# EAGLE design plug_in_A (EAGLE 9.5.2)
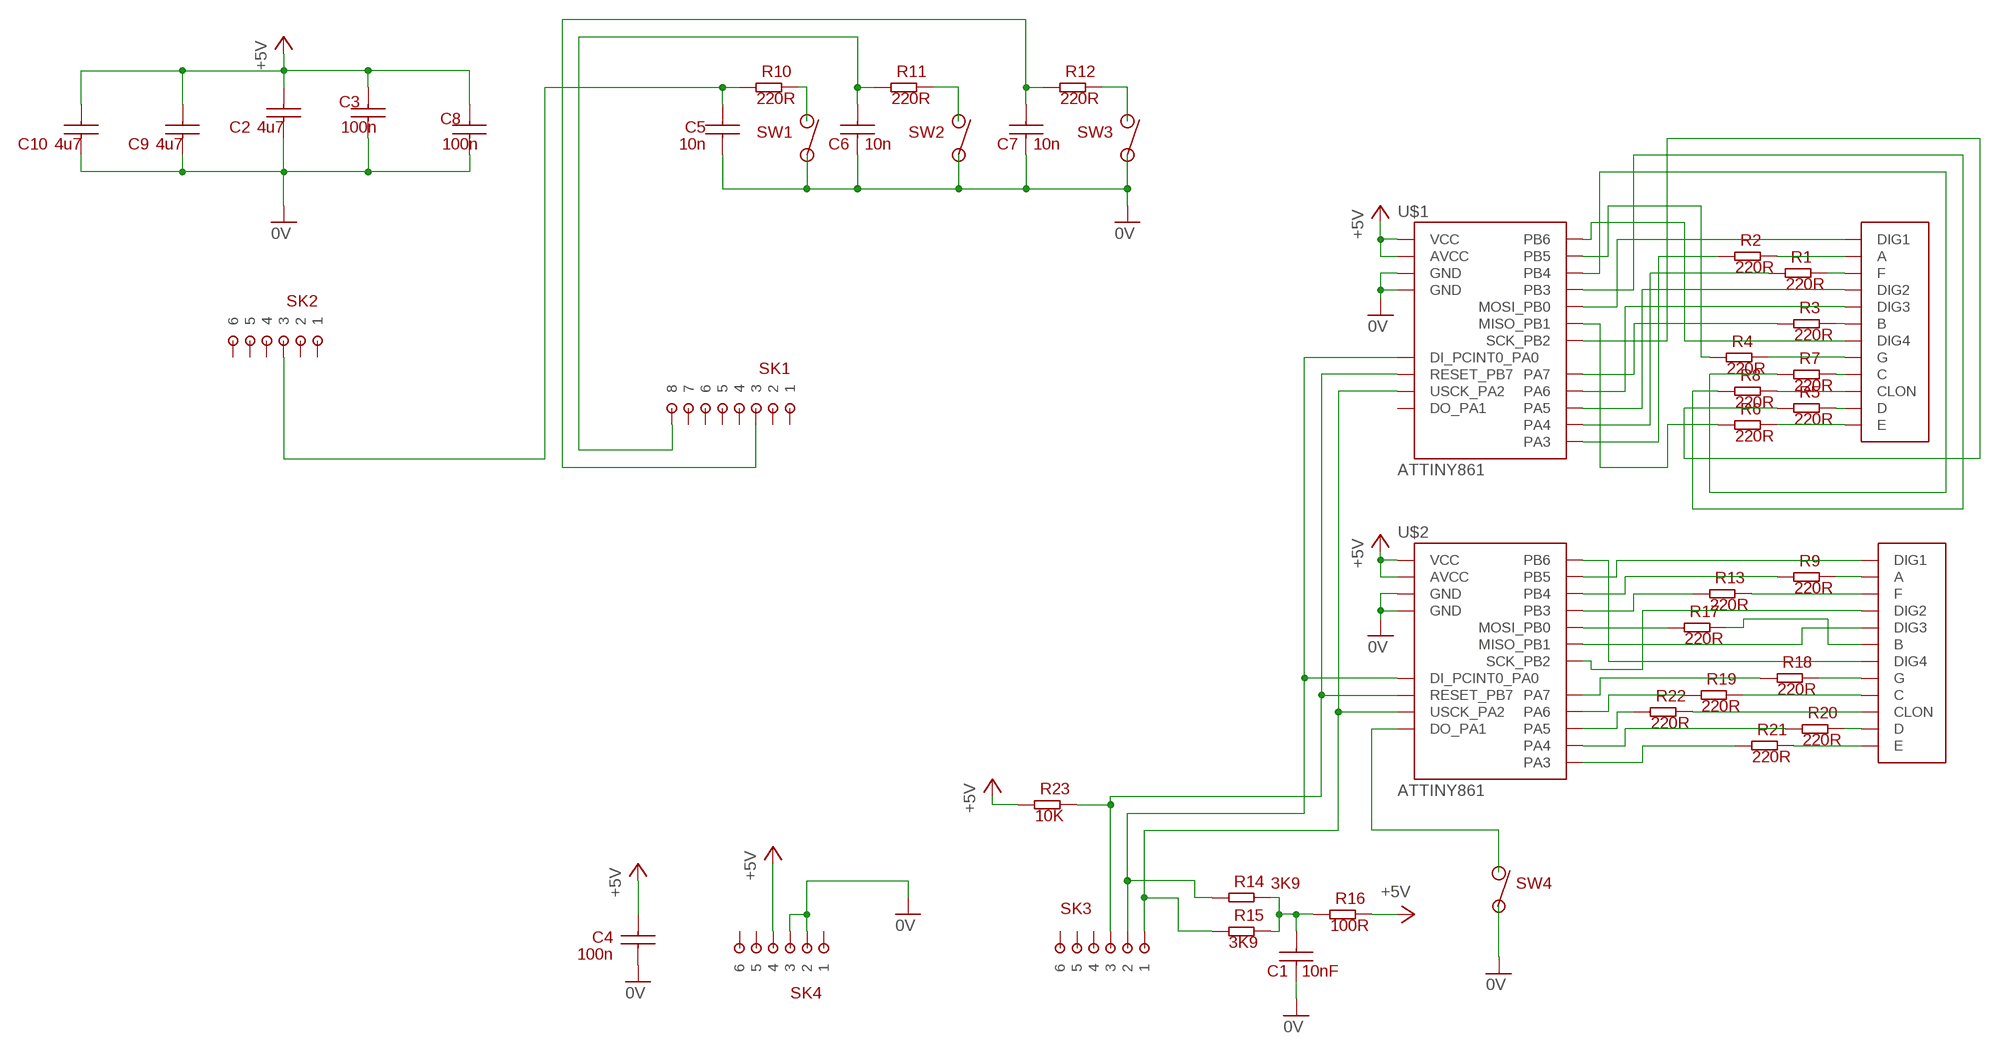
[diagram p0: schematic, sheet 1]

## Parts
C1  10nF  CAPACITOR  [1206]
C2  4u7  CAPACITOR  [1206]
C3  100n  CAPACITOR  [1206]
C4  100n  CAPACITOR  [1206]
C5  10n  CAPACITOR  [1206]
C6  10n  CAPACITOR  [1206]
C7  10n  CAPACITOR  [1206]
C8  100n  CAPACITOR  [1206]
C9  4u7  CAPACITOR  [1206]
C10  4u7  CAPACITOR  [1206]
R1  220R  RESISTOR  [1206]
R2  220R  RESISTOR  [1206]
R3  220R  RESISTOR  [1206]
R4  220R  RESISTOR  [1206]
R5  220R  RESISTOR  [1206]
R6  220R  RESISTOR  [1206]
R7  220R  RESISTOR  [1206]
R8  220R  RESISTOR  [1206]
R9  220R  RESISTOR  [1206]
R10  220R  RESISTOR  [1206]
R11  220R  RESISTOR  [1206]
R12  220R  RESISTOR  [1206]
R13  220R  RESISTOR  [1206]
R14  3K9  RESISTOR  [1206]
R15  3K9  RESISTOR  [1206]
R16  100R  RESISTOR  [1206]
R17  220R  RESISTOR  [1206]
R18  220R  RESISTOR  [1206]
R19  220R  RESISTOR  [1206]
R20  220R  RESISTOR  [1206]
R21  220R  RESISTOR  [1206]
R22  220R  RESISTOR  [1206]
R23  10K  RESISTOR  [1206]
SK1  8_WAY_HEADER  [8_WAY_HEADER]
SK2  6_WAY_HEADER  [6_WAY_HEADER]
SK3  6_WAY_HEADER  [6_WAY_HEADER]
SK4  6_WAY_HEADER  [6_WAY_HEADER]
SW1  BP_TH_NO  [PB_NO_TH]
SW2  BP_TH_NO  [PB_NO_TH]
SW3  BP_TH_NO  [PB_NO_TH]
SW4  PUSH_BUTTON_NO_SM  [PUSH_BUTTON_NO_SM]
U$1  ATTINY861  [DIL20]
U$2  ATTINY861  [DIL20]
U$3  DISPLAY  [DISPLAY]
U$4  DISPLAY  [DISPLAY]

## Nets
0V: C1.P$1 C2.P$1 C3.P$1 C4.P$1 C5.P$1 C6.P$1 C7.P$1 C8.P$1 C9.P$1 C10.P$1 SK4.P$2 SK4.P$3 SW1.P$2 SW2.P$2 SW3.P$2 SW4.P$2 U$1.6(GND) U$1.16(GND) U$2.6(GND) U$2.16(GND)
+5V: C2.P$2 C3.P$2 C4.P$2 C8.P$2 C9.P$2 C10.P$2 R16.P$2 R23.P$1 SK4.P$4 U$1.5(VCC) U$1.15(AVCC) U$2.5(VCC) U$2.15(AVCC)
N$1: SW4.P$1 U$2.19(DO_PA1)
N$2: U$1.1(MOSI_PB0) U$3.P$12(DIG1)
N$3: U$1.12(PA6) U$3.P$8(DIG3)
N$4: U$1.13(PA5) U$3.P$9(DIG2)
N$5: R2.P$1 U$1.17(PA3)
N$6: R23.P$2 SK3.P$3 U$1.10(RESET_PB7) U$2.10(RESET_PB7)
N$7: R20.P$1 U$2.14(PA4)
N$8: R6.P$1 U$1.2(MISO_PB1)
N$9: U$1.9(PB6) U$3.P$6(DIG4)
N$10: R14.P$1 SK3.P$2 U$1.20(DI_PCINT0_PA0) U$2.20(DI_PCINT0_PA0)
N$11: R15.P$1 SK3.P$1 U$1.18(USCK_PA2) U$2.18(USCK_PA2)
N$12: R10.P$2 SW1.P$1
N$13: R11.P$2 SW2.P$1
N$14: R12.P$2 SW3.P$1
N$15: C7.P$2 R12.P$1 SK1.P$3
N$16: R4.P$1 U$1.8(PB5)
N$17: C5.P$2 R10.P$1 SK2.P$3
N$18: C6.P$2 R11.P$1 SK1.P$8
N$19: C1.P$2 R14.P$2 R15.P$2 R16.P$1
N$20: R8.P$1 U$1.4(PB3)
N$21: R7.P$1 U$1.7(PB4)
N$22: R5.P$1 U$1.3(SCK_PB2)
N$23: R1.P$1 U$1.14(PA4)
N$24: R3.P$1 U$1.11(PA7)
N$25: U$2.9(PB6) U$4.P$6(DIG4)
N$26: R4.P$2 U$3.P$5(G)
N$27: R18.P$1 U$2.11(PA7)
N$28: R19.P$1 U$2.12(PA6)
N$29: R22.P$1 U$2.13(PA5)
N$30: R2.P$2 U$3.P$11(A)
N$31: R21.P$1 U$2.17(PA3)
N$32: U$2.8(PB5) U$4.P$12(DIG1)
N$33: R9.P$1 U$2.7(PB4)
N$34: R13.P$1 U$2.4(PB3)
N$35: U$2.3(SCK_PB2) U$4.P$9(DIG2)
N$36: U$2.2(MISO_PB1) U$4.P$8(DIG3)
N$37: R17.P$2 U$4.P$7(B)
N$38: R3.P$2 U$3.P$7(B)
N$39: R1.P$2 U$3.P$10(F)
N$40: R7.P$2 U$3.P$4(C)
N$41: R5.P$2 U$3.P$2(D)
N$42: R6.P$2 U$3.P$1(E)
N$43: R8.P$2 U$3.P$3(CLON)
N$44: R17.P$1 U$2.1(MOSI_PB0)
N$45: R9.P$2 U$4.P$11(A)
N$46: R13.P$2 U$4.P$10(F)
N$47: R18.P$2 U$4.P$5(G)
N$48: R19.P$2 U$4.P$4(C)
N$49: R20.P$2 U$4.P$2(D)
N$50: R21.P$2 U$4.P$1(E)
N$51: R22.P$2 U$4.P$3(CLON)
Unconnected: SK1.P$1 SK1.P$2 SK1.P$4 SK1.P$5 SK1.P$6 SK1.P$7 SK2.P$1 SK2.P$2 SK2.P$4 SK2.P$5 SK2.P$6 SK3.P$4 SK3.P$5 SK3.P$6 SK4.P$1 SK4.P$5 SK4.P$6 U$1.19(DO_PA1)

## Library data of the parts
C1-C10 = 1_home_library:CAPACITOR
R1-R23 = 1_home_library:RESISTOR
SK1 = 1_home_library:8_WAY_HEADER
SK2-SK4 = 1_home_library:6_WAY_HEADER
SW1-SW3 = 1_home_library:BP_TH_NO
SW4 = 1_home_library:PUSH_BUTTON_NO_SM
U$1 U$2 = 1_home_library_2:ATTINY861
U$3 U$4 = 1_home_library:DISPLAY

## Board
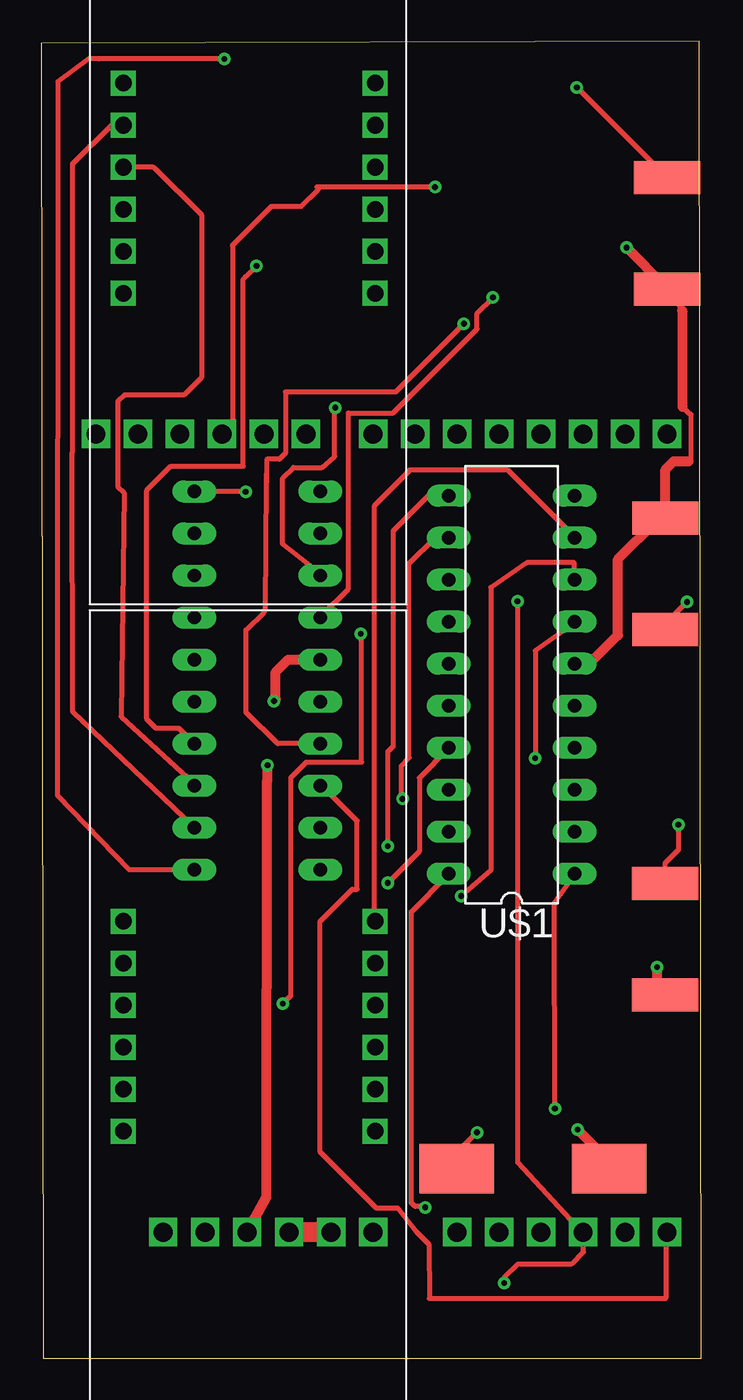
[diagram p1: board, top side]
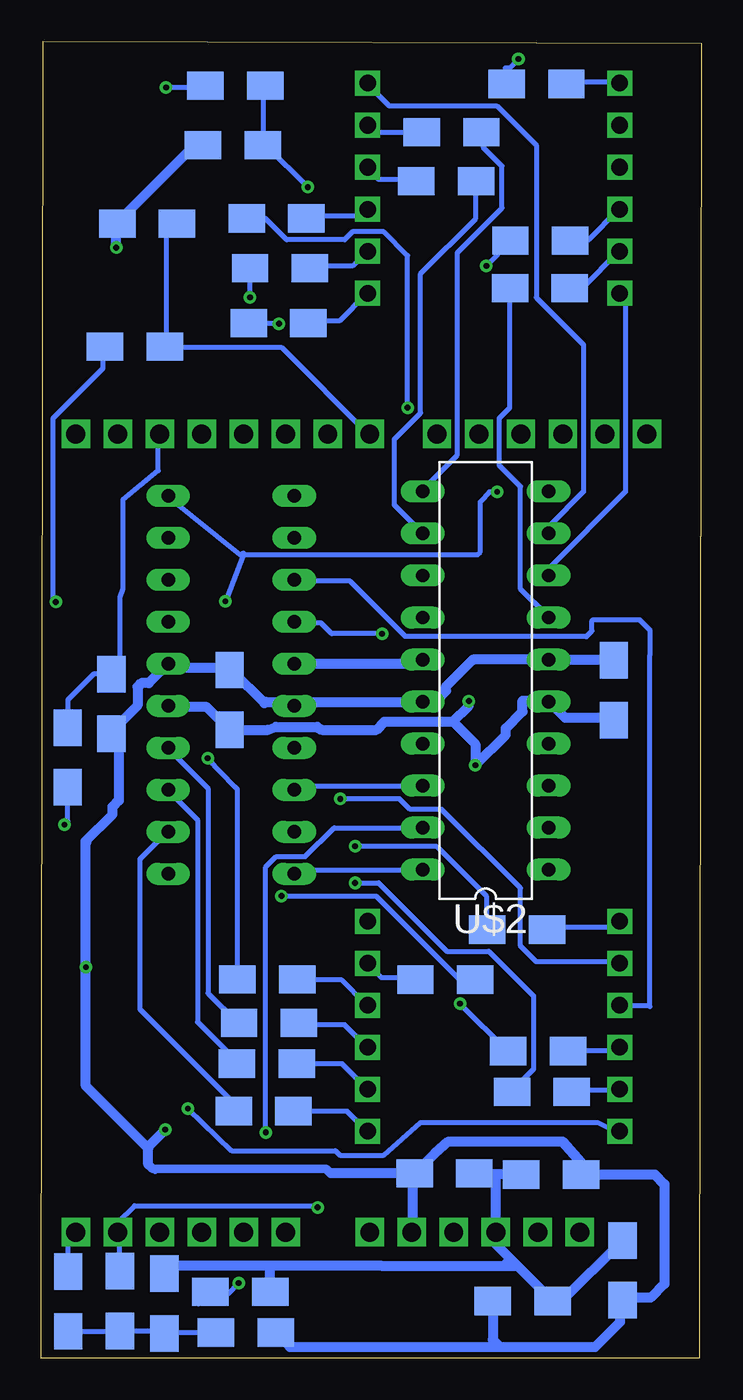
[diagram p2: board, bottom side, seen from below]

Size 39.93 x 79.62 mm. Coordinates in mm from the lower left corner, seen from the top.
Outline: 0.13,0 39.93,0 39.8,79.62 0,79.49 0.13,0
Copper layers (1*16): Top 0.035mm / dielectric 1.5mm / Bottom 0.035mm
Design rules "default *": minimum track width 12mil, minimum drill 0.35mm, track to track 12mil, track to pad 8mil, pad to pad 8mil, via to via 8mil, smd to smd 8mil, copper to edge 15mil, drill to drill 6mil, minimum pad ring 10mil, minimum via ring 8mil, stop-mask expansion 4mil, vias tented up to drill 0mil, thermal gap 10mil

### Footprints (pad centres in the part's own frame; a part is rotated, then mirrored left to right if it is on the bottom)
1206 = smd 2.2 x 1.7: P$1 0,0; P$2 3.61,0
8_WAY_HEADER = drill 1.143 square: P$1 0,0; P$2 0,-2.54; P$3 0,-5.08; P$4 0,-7.62; P$5 0,-10.16; P$6 0,-12.7; P$7 0,-15.24; P$8 0,-17.78
6_WAY_HEADER = drill 1.143 square: P$1 0,0; P$2 0,-2.54; P$3 0,-5.08; P$4 0,-7.62; P$5 0,-10.16; P$6 0,-12.7
PB_NO_TH = smd 2 x 4: P$1 0,0; P$2 6.75,0
PUSH_BUTTON_NO_SM = smd 3 x 4.5: P$1 -0.03,-0.78; P$2 -0.03,8.42
DIL20 = drill 0.813 long: 1 -11.43,-3.81; 2 -8.89,-3.81; 3 -6.35,-3.81; 4 -3.81,-3.81; 5 -1.27,-3.81; 6 1.27,-3.81; 7 3.81,-3.81; 8 6.35,-3.81; 9 8.89,-3.81; 10 11.43,-3.81; 11 11.43,3.81; 12 8.89,3.81; 13 6.35,3.81; 14 3.81,3.81; 15 1.27,3.81; 16 -1.27,3.81; 17 -3.81,3.81; 18 -6.35,3.81; 19 -8.89,3.81; 20 -11.43,3.81
DISPLAY = drill 1 square: P$1 0,0; P$2 2.54,0; P$3 5.08,0; P$4 7.62,0; P$5 10.16,0; P$6 12.7,0; P$7 12.7,15.24; P$8 10.16,15.24; P$9 7.62,15.24; P$10 5.08,15.24; P$11 2.54,15.24; P$12 0,15.24

### Placement (x,y rotation side)
C1  25.76,1.55 180 bottom
C2  12.62,3.45 0 bottom
C3  5.31,42.19 270 bottom
C4  4.78,3.51 90 bottom
C5  30.15,73.33 0 bottom
C6  35.33,68.61 0 bottom
C7  35.69,37.74 90 bottom
C8  28.55,41.61 270 bottom
C9  7.29,11.1 180 bottom
C10  17.35,11.18 0 bottom
R1  11.68,18.57 0 bottom
R2  11.46,16.1 0 bottom
R3  12.95,25.91 0 bottom
R4  13.69,22.89 180 bottom
R5  28.09,17.81 0 bottom
R6  28.3,14.94 0 bottom
R7  28.07,22.91 0 bottom
R8  27.97,20.27 0 bottom
R9  11.58,64.69 0 bottom
R10  26.39,76.94 180 bottom
R11  32.46,61.16 180 bottom
R12  38.33,38.13 270 bottom
R13  11.56,67.56 0 bottom
R14  35.18,5.26 270 bottom
R15  38.3,5.23 270 bottom
R16  32.49,1.5 90 bottom
R17  11.79,77.04 0 bottom
R18  13.31,74.12 180 bottom
R19  13.64,71.17 180 bottom
R20  27.3,65.91 0 bottom
R21  27.38,62.59 0 bottom
R22  27.51,68.91 0 bottom
R23  26.09,4.01 180 bottom
SK1  37.85,55.88 270 top
SK2  16,55.88 270 top
SK3  37.85,7.62 270 top
SK4  20.07,7.62 270 top
SW1  37.85,71.37 270 top
SW2  37.74,44.04 90 top
SW3  37.72,28.7 270 top
SW4  25.91,11.43 270 top
U$1  28.45,40.72 90 top
U$2  13.06,40.97 90 bottom
U$3  20.19,13.72 90 top
U$4  20.19,64.39 90 top

### Tracks (layer width: path | path; a pad name or v marks a point on that pad's centre or on a via)
0V  (via drill 0.35)
  Top 0.305: 37.62,21.91 SW3.P$2 37.62,22.07 | 34.45,11.59 34.43,11.56 34.35,11.48 SW4.P$2 | 37.62,50.64 37.66,50.69 SW2.P$2 37.78,50.8 | 32.38,42.07 U$1.6 | 38.75,63.34 37.94,64.61 SW1.P$2 37.78,64.77 | 38.78,57.52 39.2,57.1 39.27,57.1 39.27,54.34 39.16,54.23
  Top 0.61: 37.78,64.77 v35.4,67.15 | 33.48,11.99 33.43,11.94 33.88,11.48 34.35,11.48 | v37.24,23.65 37.24,22.43 SW3.P$2 | SW2.P$2 37.74,53.72 38.25,54.23 39.16,54.23 | 39.16,54.23 | 38.75,63.34 38.78,57.52 | U$1.6 33.15,41.99 34.87,43.71 34.87,48.31 37.25,50.69 37.66,50.69 | v32.44,13.82 34.43,11.83 34.43,11.56
  Top 1.219: SK4.P$2 SK4.P$3
  Bottom 0.305: 17.46,11.11 C10.P$1 | 17.46,7.62 SK4.P$2 | 4.92,3.49 C4.P$1 4.76,3.65 | 12.54,3.33 C2.P$1 | 7.14,10.95 C9.P$1 | 17.3,11.27 C10.P$1 | 30.8,73.18 30.16,73.18 C5.P$1 | 35.24,68.74 C6.P$1 35.4,68.58 | 5.4,42.23 C3.P$1 | 9.21,42.23 U$2.6 9.37,42.23 | 32.38,41.91 U$1.6 32.38,41.75 | 28.57,41.75 C8.P$1 28.42,41.59 | U$1.16 24.77,39.53 26.35,39.53 26.43,39.61 26.35,39.69 | 16.99,39.69 U$2.16 16.83,39.85 | 33.47,11.72 33.02,11.27 | 17.46,11.27 C10.P$1
  Bottom 0.508: 22.43,11.18 22.71,11.46 33.2,11.46 33.47,11.72
  Bottom 0.61: 17.46,7.62 17.46,11.11 | 35.24,68.74 30.8,73.18 | 9.21,42.23 5.4,42.23 | 32.38,41.75 28.57,41.75 | 28.42,41.59 26.43,39.61 | 26.35,39.69 16.99,39.69 | v35.4,67.15 35.4,68.58 | 22.43,11.18 C10.P$1 16.1,12.42 15.29,13.11 8.41,13.11 7.29,11.84 C9.P$1 2.82,11.1 2.23,10.52 2.23,4.5 3.08,3.65 4.76,3.65 | C2.P$1 12.62,1.12 12.19,0.69 | 12.19,0.69 6.43,0.69 4.92,2.19 4.92,3.49 | 37.21,31.19 37.26,31.24 | 37.26,31.24 35.62,32.88 35.62,33.34 35.24,33.72 35.24,37.3 C7.P$1 35.69,37.9 34.11,39.47 34.11,40.59 33.88,40.82 33.43,40.82 U$1.6 | C1.P$1 24.89,0.69 12.19,0.69 | 33.47,11.72 33.47,12.69 | 33.47,12.69 37.24,16.46 v37.24,23.65 37.26,23.67 37.26,31.24 | v32.44,13.82 33.47,12.79 33.47,12.69 | U$2.16 16.74,39.83 15.98,39.83 15.44,40.36 15.44,40.62 13.83,42.23 | 13.83,42.23 13.77,42.23 | U$2.6 13.82,42.24 13.83,42.23
+5V  (via drill 0.35)
  Top 0.305: 16.83,42.23 U$2.15 | 12.54,7.62 SK4.P$4
  Top 0.61: SK4.P$4 13.61,9.75 13.66,34.92 13.68,34.94 v13.68,35.85 | 15.82,42.27 16.79,42.27 16.83,42.23 | v14.07,39.73 14.17,39.83 14.17,41.48 14.94,42.24 U$2.15
  Bottom 0.305: 8.41,3.49 8.89,3.49 C2.P$2 9.05,3.49 | 4.92,6.99 C4.P$2 | 10.95,11.11 C9.P$2 | 13.65,11.11 C10.P$2 | 12.38,7.62 SK4.P$4 12.86,7.3 | 24.61,41.91 U$1.15 | 16.99,42.23 U$2.15 | 5.4,38.73 C3.P$2 | 9.21,39.69 U$2.5 9.37,39.69 | 28.57,38.1 C8.P$2 28.42,38.1 28.26,38.26 | 32.23,39.37 U$1.5
  Bottom 0.61: 4.92,6.99 8.41,3.49 | 5.4,38.73 8.26,38.73 9.21,39.69 | 15.04,38.48 19.18,38.48 19.66,37.99 22.96,37.99 23.24,38.18 25.76,38.18 26.22,37.99 C8.P$2 29.92,39.37 32.23,39.37 | 9.28,39.74 U$2.5 | U$1.15 17.12,41.99 U$2.15 | 11.54,5.99 12.45,6.89 SK4.P$4 12.45,10.95 12.29,11.1 | 11.54,5.99 11.13,5.58 | 11.13,5.58 9.05,3.49 | 11.54,5.99 11.91,5.61 | 11.13,5.58 19.31,5.58 19.91,5.59 26.11,5.59 | 9.37,39.69 9.43,39.75 10.82,39.75 10.82,39.09 11.84,38.08 11.84,37.69 v13.68,35.85 13.68,37.12 15.04,38.48 | 15.04,38.48 14.07,39.45 v14.07,39.73 | C9.P$2 12.29,11.1 | 12.29,11.1 13.66,11.1 C10.P$2 | 26.11,5.59 32,5.59 R16.P$2 | R23.P$1 26.09,5.57 26.11,5.59
N$1  (via drill 0.35)
  Top 0.305: v26.35,13.65 25.24,12.54 25.24,11.59 SW4.P$1
  Bottom 0.305: v26.35,13.65 26.35,29.69 25.72,30.32 23.97,30.32 22.23,32.07 16.99,32.07 U$2.19
N$2  (via drill 0.35)
  Top 0.305: v31.06,15.09 31.04,27.52 32.23,29.21 U$1.1
  Bottom 0.305: v31.06,15.09 28.42,12.54 22.14,12.54 21.87,12.27 19.23,12.27 16.99,14.25 6.29,14.25 5.08,13.65 U$3.P$12
N$3  (via drill 0.35)
  Top 0.305: 24.61,49.53 U$1.12 23.82,49.61 22.25,48.03 22.25,36.3 21.77,35.81 21.77,33.89 v21.84,33.81
  Bottom 0.305: v21.84,33.81 18.26,33.81 17.62,33.18 15.72,33.18 10.95,28.42 10.95,24.92 10,23.97 5.08,23.97 U$3.P$8
N$4
  Bottom 0.305: U$1.13 24.61,46.99 21.27,46.99 17.94,43.66 7.03,43.66 6.99,43.61 6.63,43.97 6.63,44.58 6.55,44.65 3.76,44.65 3.1,43.99 3.12,43.97 3.12,42.52 3.12,21.26 3.2,21.34 U$3.P$9 4.92,21.43
N$5  (via drill 0.35)
  Top 0.305: v20.95,28.73 22.86,30.64 22.86,35.08 24.61,36.83 U$1.17
  Bottom 0.305: v20.95,28.73 19.53,28.73 15.4,24.61 12.86,24.61 10.16,21.91 10.16,17.46 11.43,16.19 R2.P$1
N$6  (via drill 0.35)
  Top 0.305: v12.36,52.39 9.37,52.39 U$2.10 | v28.8,45.76 28.8,11.83 32.7,7.62 SK3.P$3 32.77,6.45 32.79,6.43 32.05,5.69 28.83,5.69 27.99,4.85 v27.99,4.55
  Bottom 0.305: 12.83,52.39 v12.36,52.39 12.76,52.39 13.39,51.77 13.39,48.74 13.55,48.58 27.9,48.58 | 27.9,48.58 27.68,48.68 v28.8,45.76 | 27.9,48.58 32.23,52.07 U$1.10 | 30.43,3.28 29.83,3.88 | 29.83,3.88 R23.P$2 | v27.99,4.55 28.66,3.88 29.83,3.88
N$7  (via drill 0.35)
  Top 0.305: v27.3,64.14 26.35,63.18 26.35,62.23 21.27,57.15 18.57,57.15 18.57,46.51 16.99,44.93 U$2.14
  Bottom 0.305: v27.3,64.14 R20.P$1
N$8
  Bottom 0.305: R6.P$1 28.42,15.08 28.42,15.56 33.97,21.11 33.97,30.16 32.38,31.75 U$1.2
N$9
  Top 0.305: U$1.9 32.23,49.69 28.22,53.7 22.3,53.7 20.16,51.56 20.16,26.51 U$3.P$6
N$10  (via drill 0.35)
  Top 0.305: U$1.20 24.61,29.21 22.38,26.99 22.38,9.39 22.61,9.17 23.16,9.17 v23.22,9.12
  Bottom 0.305: U$2.20 16.99,29.53 24.45,29.53 24.61,29.37 U$1.20 | v23.22,9.12 23.32,9.22 34.29,9.22 35.31,8.2 SK3.P$2 35.24,7.62 35.18,7.56 R14.P$1
N$11
  Top 0.305: U$2.18 16.99,34.61 19.1,32.49 19.1,28.35 18.8,28.35 16.87,26.42 16.87,12.47 20.27,9.07 21.57,9.07 22.66,7.67 23.44,6.88 23.47,3.61 37.76,3.61 37.78,7.62 SK3.P$1
  Bottom 0.305: U$2.18 16.99,34.61 24.45,34.61 24.61,34.45 U$1.18 | SK3.P$1 37.78,7.62 38.3,7.1 R15.P$1
N$12  (via drill 0.35)
  Top 0.305: SW1.P$1 v32.38,76.83
  Bottom 0.305: v32.38,76.83 30,76.83 R10.P$2
N$13  (via drill 0.35)
  Top 0.305: v39.05,45.72 37.78,44.45 37.78,44.13 SW2.P$1
  Bottom 0.305: v39.05,45.72 39.21,45.88 39.21,56.83 36.2,59.85 36.2,61.12 R11.P$2
N$14  (via drill 0.35)
  Top 0.305: 37.78,28.73 SW3.P$1 37.72,29.92 38.53,30.73 v38.53,32.26
  Bottom 0.305: v38.53,32.26 38.33,32.46 R12.P$2
N$15
  Bottom 0.305: SK1.P$3 32.86,55.88 32.86,53.66 35.01,51.89 35.01,46.84 35,46.51 35.18,46 35.18,41.86 C7.P$2 36.78,41.35 38.33,39.8 R12.P$1
N$16  (via drill 0.35)
  Top 0.305: v25.4,27.94 27.19,29.48 27.19,46.61 29.37,48.1 32.23,48.1 32.23,47.15 U$1.8
  Bottom 0.305: v25.4,27.94 19.68,27.94 14.76,23.02 13.81,23.02 R4.P$1
N$17  (via drill 0.35)
  Top 0.305: v23.81,70.8 16.74,70.8 | 16.74,70.8 16.67,70.8 | SK2.P$3 10.95,55.88 11.59,56.52 11.59,67.25 11.56,67.28 13.92,69.65 15.72,69.65 16.74,70.66 16.74,70.8
  Bottom 0.305: R10.P$1 26.51,76.83 26.51,73.34 C5.P$2 26.35,73.34 v23.81,70.8
N$18
  Bottom 0.305: C6.P$2 31.75,68.58 32.38,67.94 32.38,61.28 R11.P$1 32.38,61.12 25.4,61.12 20.16,55.88 SK1.P$8
N$19
  Bottom 0.305: R15.P$2 35.2,1.62 R14.P$2 32.64,1.65 32.54,1.55 | 32.54,1.55 R16.P$1 | C1.P$2 32.54,1.55
N$20
  Bottom 0.305: R8.P$1 28.1,20.32 29.84,22.07 29.84,34.45 32.23,36.83 U$1.4
N$21  (via drill 0.35)
  Top 0.305: v29.87,36.27 29.87,42.78 32.23,44.45 U$1.7
  Bottom 0.305: v29.87,36.27 28.2,34.52 28.07,34.39 R7.P$1
N$22
  Bottom 0.305: R5.P$1 28.1,17.94 30.48,20.32 30.48,32.54 32.23,34.29 U$1.3
N$23  (via drill 0.35)
  Top 0.305: v14.61,21.43 15.08,21.91 15.08,35.08 16.03,36.04 19.37,36.04 19.37,43.75 v19.32,43.8
  Bottom 0.305: v14.61,21.43 11.75,18.57 R1.P$1 | U$1.14 24.61,44.45 23.01,44.45 22.36,43.8 v19.32,43.8
N$24  (via drill 0.35)
  Top 0.305: 20.8,31.11 v20.95,30.96 | 24.61,52.07 U$1.11 24.64,52.07 23.32,52.07 21.29,50.04 21.29,37.01 20.95,36.68 v20.95,30.96 | v20.95,30.96 21.11,31.11
  Bottom 0.305: v20.95,30.96 16.03,30.96 13.02,27.94 13.02,26.04 R3.P$1
N$25
  Bottom 0.305: U$2.9 9.21,50.01 9.21,50.32 7.14,52.39 7.14,61.28 10,64.14 10,73.34 12.38,75.72 18.89,75.72 20.16,76.99 U$4.P$6
N$26
  Bottom 0.305: R4.P$2 17.3,23.02 19.37,23.02 20.16,23.81 U$3.P$5
N$27
  Bottom 0.305: R18.P$1 13.18,73.98 13.18,73.18 12.06,72.07 12.06,69.53 14.76,66.83 14.76,54.61 16.83,52.55 U$2.11
N$28
  Bottom 0.305: R19.P$1 13.65,71.12 13.65,68.9 16.99,65.56 16.99,57.15 18.57,55.56 18.57,51.59 16.99,50.01 U$2.12
N$29  (via drill 0.35)
  Top 0.305: v17.78,57.47 17.74,57.32 17.74,54.52 16.97,53.85 15.24,53.85 14.6,53.21 14.6,49.21 16.83,47.47 U$2.13
  Bottom 0.305: v17.78,57.47 17.78,66.67 19.21,68.1 21.11,68.1 21.59,67.63 25.08,67.63 26.35,68.9 27.46,68.9 R22.P$1
N$30
  Bottom 0.305: R2.P$2 7.78,16.19 5.08,16.19 U$3.P$11
N$31  (via drill 0.35)
  Top 0.305: v25.56,62.55 21.43,58.42 14.76,58.42 14.76,54.72 14.4,54.36 13.66,54.36 13.63,54.32 13.63,52.98 | 13.63,52.98 13.56,45.31 13.46,45.09 12.42,44.04 12.37,44.04 12.37,39.04 14.3,37.16 U$2.17 | 13.63,52.98 13.63,53.49
  Bottom 0.305: v25.56,62.55 27.3,62.55 R21.P$1
N$32
  Bottom 0.305: U$2.8 9.21,47.47 9.21,47.78 4.6,52.39 4.6,63.98 4.92,64.29 U$4.P$12
N$33
  Bottom 0.305: R9.P$1 11.59,64.61 11.59,57.47 12.22,56.83 12.22,53.98 10.95,52.7 10.95,46.51 9.37,44.93 U$2.7
N$34  (via drill 0.35)
  Top 0.305: v13.02,66.04 12.39,65.41 12.22,65.25 12.22,65.24 12.22,53.92 7.82,53.92 6.38,52.48 6.38,38.63 6.93,38.08 8.33,38.08 U$2.4
  Bottom 0.305: v13.02,66.04 11.59,67.47 R13.P$1
N$35
  Top 0.305: U$2.3 9.21,34.77 4.82,38.8 5,52.33 4.63,52.7 4.63,57.84 5.03,58.24 8.64,58.24 9.68,59.29 9.68,69.13 6.81,72.01 U$4.P$9 4.92,72.07
N$36
  Top 0.305: 9.21,32.23 U$2.2 1.91,39.06 1.85,54.65 1.89,54.88 1.89,72.22 4.27,74.55 U$4.P$8
N$37
  Bottom 0.305: R17.P$2 8.1,77.15 5.08,77.15 U$4.P$7
N$38
  Bottom 0.305: R3.P$2 9.21,26.04 5.4,26.04 5.08,26.35 U$3.P$7
N$39
  Bottom 0.305: R1.P$2 7.94,18.57 5.24,18.57 5.08,18.73 U$3.P$10
N$40
  Bottom 0.305: R7.P$2 24.45,22.86 21.75,22.86 20.32,21.43 U$3.P$4
N$41
  Bottom 0.305: U$3.P$2 21.74,17.8 R5.P$2
N$42
  Bottom 0.305: R6.P$2 24.61,14.92 21.43,14.92 20.32,13.81 U$3.P$1
N$43
  Bottom 0.305: R8.P$2 24.29,20.16 21.59,20.16 20.32,18.89 U$3.P$3
N$44  (via drill 0.35)
  Top 0.305: v11.07,78.56 3.49,78.56 2.87,78.56 0.99,77.19 0.96,34.04 5.28,29.54 U$2.1
  Bottom 0.305: 11.75,76.99 R17.P$1 11.86,77.11 11.86,78 11.63,78 v11.07,78.56
N$45
  Bottom 0.305: R9.P$2 7.94,64.77 7.14,64.77 5.08,66.83 U$4.P$11
N$46
  Bottom 0.305: R13.P$2 7.94,67.63 6.83,67.63 5.08,69.37 U$4.P$10
N$47
  Bottom 0.305: R18.P$2 16.99,74.14 19.84,74.14 20.16,74.45 U$4.P$5
N$48
  Bottom 0.305: R19.P$2 17.3,71.28 19.53,71.28 20.16,71.91 U$4.P$4
N$49
  Bottom 0.305: R20.P$2 23.65,66.04 21.11,66.04 20.32,66.83 U$4.P$2
N$50
  Bottom 0.305: R21.P$2 23.65,62.71 21.91,62.71 20.32,64.29 U$4.P$1
N$51
  Bottom 0.305: R22.P$2 23.81,69.06 20.64,69.06 20.32,69.37 U$4.P$3